# Altium schematic sheet Sensors.SchDoc
size A4; SheetNumber: 2; SheetTotal: 5
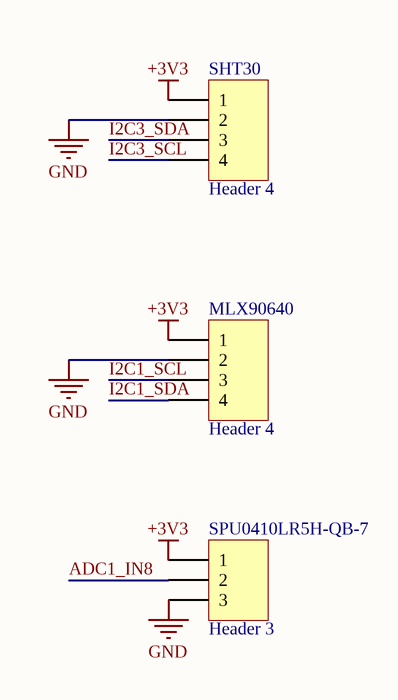
[diagram p0: Sensors.SchDoc]

## Parts
MLX90640  Header 4  [HDR1X4]
SHT30  Header 4  [HDR1X4]
SPU0410LR5H-QB-7  Header 3  [HDR1X3]

## Nets
+3V3: MLX90640.1 SHT30.1 SPU0410LR5H-QB-7.1
GND: MLX90640.2 SHT30.2 SPU0410LR5H-QB-7.3
ADC1_IN8: SPU0410LR5H-QB-7.2
I2C1_SCL: MLX90640.3
I2C1_SDA: MLX90640.4
I2C3_SCL: SHT30.4
I2C3_SDA: SHT30.3

## Library data of the parts
MLX90640 SHT30 = Header 4: Header, 4-Pin; LatestRevisionDate: 17-Jul-2002; LatestRevisionNote: Re-released for DXP Platform.; Publisher: Altium Limited
SPU0410LR5H-QB-7 = Header 3: Header, 3-Pin; LatestRevisionDate: 17-Jul-2002; LatestRevisionNote: Re-released for DXP Platform.; Publisher: Altium Limited